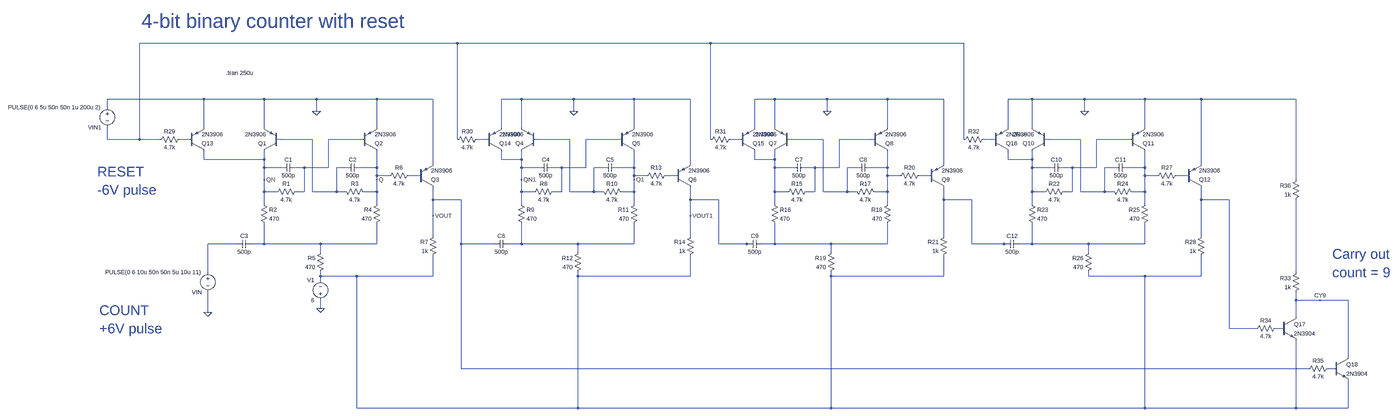
[diagram p0: schematic couter_4bit.asc, whole sheet]
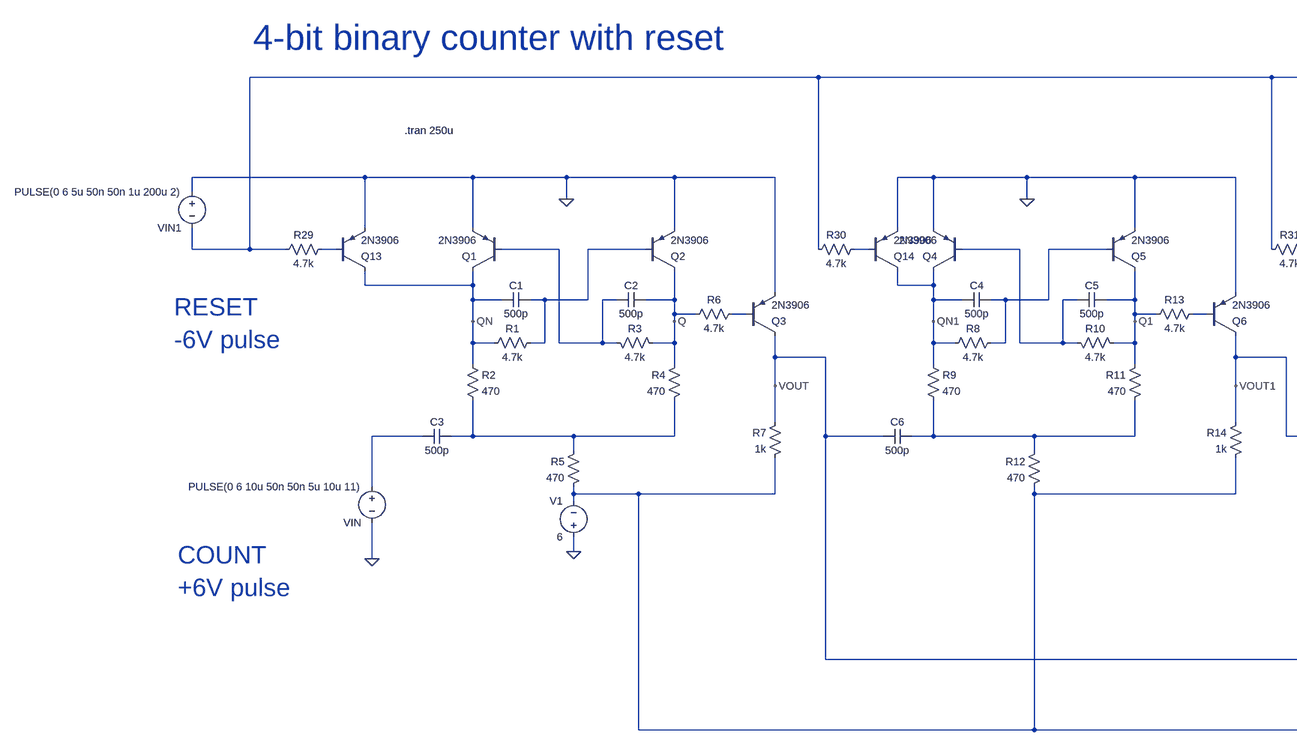
[diagram p1: schematic couter_4bit.asc, part, row 1 of 1, column 1 of 2]
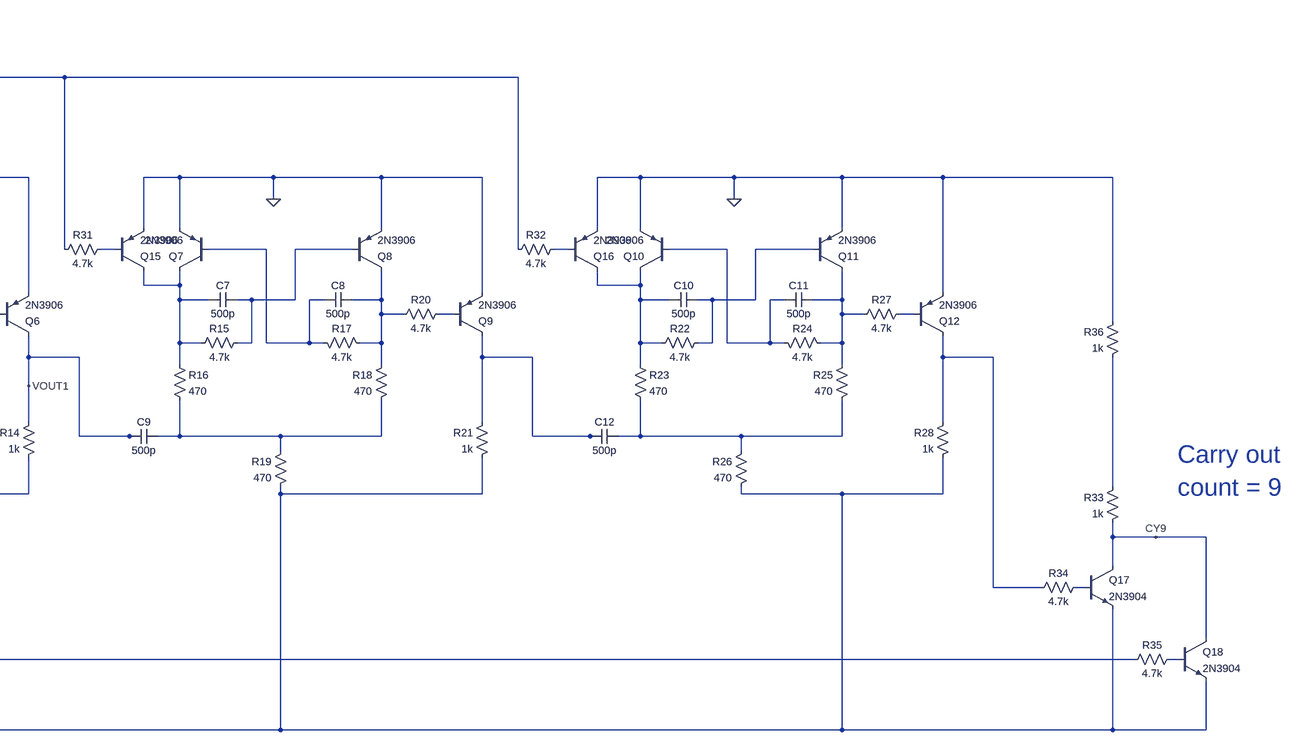
[diagram p2: schematic couter_4bit.asc, part, row 1 of 1, column 2 of 2]
couter_4bit.asc, the LTspice schematic file:
Version 4
SHEET 1 4568 1448
WIRE 688 -208 -576 -208
WIRE 1696 -208 688 -208
WIRE 2704 -208 1696 -208
WIRE -320 48 -704 48
WIRE -80 48 -320 48
WIRE 128 48 -80 48
WIRE 368 48 128 48
WIRE 592 48 368 48
WIRE 944 48 864 48
WIRE 1152 48 944 48
WIRE 1392 48 1152 48
WIRE 1616 48 1392 48
WIRE 1952 48 1872 48
WIRE 2160 48 1952 48
WIRE 2400 48 2160 48
WIRE 2624 48 2400 48
WIRE 2976 48 2880 48
WIRE 3184 48 2976 48
WIRE 3424 48 3184 48
WIRE 3648 48 3424 48
WIRE 4144 48 3648 48
WIRE -704 80 -704 48
WIRE 128 96 128 48
WIRE 1152 96 1152 48
WIRE 2160 96 2160 48
WIRE 3184 96 3184 48
WIRE -320 160 -320 48
WIRE -80 160 -80 48
WIRE 368 160 368 48
WIRE 864 160 864 48
WIRE 944 160 944 48
WIRE 1392 160 1392 48
WIRE 1872 160 1872 48
WIRE 1952 160 1952 48
WIRE 2400 160 2400 48
WIRE 2880 160 2880 48
WIRE 2976 160 2976 48
WIRE 3424 160 3424 48
WIRE -704 208 -704 160
WIRE -576 208 -576 -208
WIRE -576 208 -704 208
WIRE -496 208 -576 208
WIRE -384 208 -416 208
WIRE 112 208 -16 208
WIRE 304 208 176 208
WIRE 688 208 688 -208
WIRE 800 208 768 208
WIRE 1136 208 1008 208
WIRE 1328 208 1200 208
WIRE 1696 208 1696 -208
WIRE 1808 208 1776 208
WIRE 2144 208 2016 208
WIRE 2336 208 2208 208
WIRE 2704 208 2704 -208
WIRE 2816 208 2784 208
WIRE 3168 208 3040 208
WIRE 3360 208 3232 208
WIRE -320 288 -320 256
WIRE -80 288 -80 256
WIRE -80 288 -320 288
WIRE 864 288 864 256
WIRE 944 288 944 256
WIRE 944 288 864 288
WIRE 1872 288 1872 256
WIRE 1952 288 1952 256
WIRE 1952 288 1872 288
WIRE 2880 288 2880 256
WIRE 2976 288 2976 256
WIRE 2976 288 2880 288
WIRE 592 304 592 48
WIRE 1616 304 1616 48
WIRE 2624 304 2624 48
WIRE 3648 304 3648 48
WIRE -80 320 -80 288
WIRE -16 320 -80 320
WIRE 80 320 48 320
WIRE 176 320 176 208
WIRE 176 320 80 320
WIRE 240 320 208 320
WIRE 368 320 368 256
WIRE 368 320 304 320
WIRE 944 320 944 288
WIRE 1008 320 944 320
WIRE 1104 320 1072 320
WIRE 1200 320 1200 208
WIRE 1200 320 1104 320
WIRE 1264 320 1232 320
WIRE 1392 320 1392 256
WIRE 1392 320 1328 320
WIRE 1952 320 1952 288
WIRE 2016 320 1952 320
WIRE 2112 320 2080 320
WIRE 2208 320 2208 208
WIRE 2208 320 2112 320
WIRE 2272 320 2240 320
WIRE 2400 320 2400 256
WIRE 2400 320 2336 320
WIRE 2976 320 2976 288
WIRE 3040 320 2976 320
WIRE 3136 320 3104 320
WIRE 3232 320 3232 208
WIRE 3232 320 3136 320
WIRE 3296 320 3264 320
WIRE 3424 320 3424 256
WIRE 3424 320 3360 320
WIRE 368 352 368 320
WIRE 416 352 368 352
WIRE 528 352 496 352
WIRE 1392 352 1392 320
WIRE 1440 352 1392 352
WIRE 1552 352 1520 352
WIRE 2400 352 2400 320
WIRE 2448 352 2400 352
WIRE 2560 352 2528 352
WIRE 3424 352 3424 320
WIRE 3472 352 3424 352
WIRE 3584 352 3552 352
WIRE -80 368 -80 320
WIRE 368 368 368 352
WIRE 944 368 944 320
WIRE 1392 368 1392 352
WIRE 4144 368 4144 48
WIRE -80 416 -80 368
WIRE -32 416 -80 416
WIRE 80 416 80 320
WIRE 80 416 48 416
WIRE 112 416 112 208
WIRE 208 416 208 320
WIRE 208 416 112 416
WIRE 240 416 208 416
WIRE 368 416 368 368
WIRE 368 416 320 416
WIRE 944 416 944 368
WIRE 992 416 944 416
WIRE 1104 416 1104 320
WIRE 1104 416 1072 416
WIRE 1136 416 1136 208
WIRE 1232 416 1232 320
WIRE 1232 416 1136 416
WIRE 1264 416 1232 416
WIRE 1392 416 1392 368
WIRE 1392 416 1344 416
WIRE 1952 416 1952 320
WIRE 2000 416 1952 416
WIRE 2112 416 2112 320
WIRE 2112 416 2080 416
WIRE 2144 416 2144 208
WIRE 2240 416 2240 320
WIRE 2240 416 2144 416
WIRE 2272 416 2240 416
WIRE 2400 416 2400 352
WIRE 2400 416 2352 416
WIRE 2976 416 2976 320
WIRE 3024 416 2976 416
WIRE 3136 416 3136 320
WIRE 3136 416 3104 416
WIRE 3168 416 3168 208
WIRE 3264 416 3264 320
WIRE 3264 416 3168 416
WIRE 3296 416 3264 416
WIRE 3424 416 3424 352
WIRE 3424 416 3376 416
WIRE 592 448 592 400
WIRE 704 448 592 448
WIRE 1616 448 1616 400
WIRE 1728 448 1616 448
WIRE 2624 448 2624 400
WIRE 2736 448 2624 448
WIRE 3648 448 3648 400
WIRE 3760 448 3648 448
WIRE -80 464 -80 416
WIRE 368 464 368 416
WIRE 944 464 944 416
WIRE 1392 464 1392 416
WIRE 1952 464 1952 416
WIRE 2400 464 2400 416
WIRE 2976 464 2976 416
WIRE 3424 464 3424 416
WIRE 592 512 592 448
WIRE 1616 512 1616 448
WIRE 592 592 592 512
WIRE 1616 592 1616 512
WIRE 2624 592 2624 448
WIRE 3648 592 3648 448
WIRE -192 624 -304 624
WIRE -80 624 -80 544
WIRE -80 624 -128 624
WIRE 144 624 -80 624
WIRE 368 624 368 544
WIRE 368 624 144 624
WIRE 704 624 704 448
WIRE 832 624 704 624
WIRE 944 624 944 544
WIRE 944 624 896 624
WIRE 1168 624 944 624
WIRE 1392 624 1392 544
WIRE 1392 624 1168 624
WIRE 1728 624 1728 448
WIRE 1840 624 1728 624
WIRE 1856 624 1840 624
WIRE 1952 624 1952 544
WIRE 1952 624 1904 624
WIRE 2176 624 1952 624
WIRE 2400 624 2400 544
WIRE 2400 624 2176 624
WIRE 2736 624 2736 448
WIRE 2864 624 2736 624
WIRE 2880 624 2864 624
WIRE 2976 624 2976 544
WIRE 2976 624 2928 624
WIRE 3200 624 2976 624
WIRE 3424 624 3424 544
WIRE 3424 624 3200 624
WIRE 144 656 144 624
WIRE 1168 656 1168 624
WIRE 2176 656 2176 624
WIRE 3200 656 3200 624
WIRE -304 736 -304 624
WIRE 4144 736 4144 448
WIRE 144 752 144 736
WIRE 288 752 144 752
WIRE 592 752 592 672
WIRE 592 752 288 752
WIRE 1168 752 1168 736
WIRE 1616 752 1616 672
WIRE 1616 752 1168 752
WIRE 2176 752 2176 736
WIRE 2624 752 2624 672
WIRE 2624 752 2176 752
WIRE 3200 752 3200 736
WIRE 3424 752 3200 752
WIRE 3648 752 3648 672
WIRE 3648 752 3424 752
WIRE 144 768 144 752
WIRE 4144 848 4144 816
WIRE 4240 848 4144 848
WIRE 4352 848 4240 848
WIRE 144 880 144 848
WIRE -304 896 -304 816
WIRE 4144 912 4144 848
WIRE 3760 960 3760 448
WIRE 3984 960 3760 960
WIRE 4080 960 4064 960
WIRE 4352 1072 4352 848
WIRE 704 1120 704 624
WIRE 4192 1120 704 1120
WIRE 4288 1120 4272 1120
WIRE 288 1440 288 752
WIRE 1168 1440 1168 752
WIRE 1168 1440 288 1440
WIRE 2176 1440 2176 752
WIRE 2176 1440 1168 1440
WIRE 3424 1440 3424 752
WIRE 3424 1440 2176 1440
WIRE 4144 1440 4144 1008
WIRE 4144 1440 3424 1440
WIRE 4352 1440 4352 1168
WIRE 4352 1440 4144 1440
FLAG 128 96 0
FLAG 144 880 0
FLAG -304 896 0
FLAG 368 368 Q
FLAG -80 368 QN
FLAG 592 512 VOUT
FLAG 1152 96 0
FLAG 1392 368 Q1
FLAG 944 368 QN1
FLAG 1616 512 VOUT1
FLAG 2160 96 0
FLAG 3184 96 0
FLAG 4240 848 CY9
SYMBOL pnp -16 256 R180
SYMATTR InstName Q1
SYMATTR Value 2N3906
SYMBOL cap 48 304 R90
WINDOW 0 0 32 VBottom 2
WINDOW 3 32 32 VTop 2
SYMATTR InstName C1
SYMATTR Value 500p
SYMBOL res 64 400 R90
WINDOW 0 0 56 VBottom 2
WINDOW 3 32 56 VTop 2
SYMATTR InstName R1
SYMATTR Value 4.7k
SYMBOL res -96 448 R0
SYMATTR InstName R2
SYMATTR Value 470
SYMBOL pnp 304 256 M180
SYMATTR InstName Q2
SYMATTR Value 2N3906
SYMBOL cap 240 304 M90
WINDOW 0 0 32 VBottom 2
WINDOW 3 32 32 VTop 2
SYMATTR InstName C2
SYMATTR Value 500p
SYMBOL res 224 400 M90
WINDOW 0 0 56 VBottom 2
WINDOW 3 32 56 VTop 2
SYMATTR InstName R3
SYMATTR Value 4.7k
SYMBOL res 384 448 M0
SYMATTR InstName R4
SYMATTR Value 470
SYMBOL res 160 640 M0
SYMATTR InstName R5
SYMATTR Value 470
SYMBOL cap -128 608 R90
WINDOW 0 0 32 VBottom 2
WINDOW 3 32 32 VTop 2
SYMATTR InstName C3
SYMATTR Value 500p
SYMBOL voltage 144 864 R180
WINDOW 0 24 96 Left 2
WINDOW 3 24 16 Left 2
WINDOW 123 0 0 Left 0
WINDOW 39 0 0 Left 0
SYMATTR InstName V1
SYMATTR Value 6
SYMBOL voltage -304 720 M0
WINDOW 0 24 96 Left 2
WINDOW 3 24 16 Left 2
WINDOW 123 0 0 Left 0
WINDOW 39 0 0 Left 0
SYMATTR InstName VIN
SYMATTR Value PULSE(0 6 10u 50n 50n 5u 10u 11)
SYMBOL pnp 528 400 M180
SYMATTR InstName Q3
SYMATTR Value 2N3906
SYMBOL res 512 336 R90
WINDOW 0 0 56 VBottom 2
WINDOW 3 32 56 VTop 2
SYMATTR InstName R6
SYMATTR Value 4.7k
SYMBOL res 608 576 M0
SYMATTR InstName R7
SYMATTR Value 1k
SYMBOL pnp 1008 256 R180
SYMATTR InstName Q4
SYMATTR Value 2N3906
SYMBOL cap 1072 304 R90
WINDOW 0 0 32 VBottom 2
WINDOW 3 32 32 VTop 2
SYMATTR InstName C4
SYMATTR Value 500p
SYMBOL res 1088 400 R90
WINDOW 0 0 56 VBottom 2
WINDOW 3 32 56 VTop 2
SYMATTR InstName R8
SYMATTR Value 4.7k
SYMBOL res 928 448 R0
SYMATTR InstName R9
SYMATTR Value 470
SYMBOL pnp 1328 256 M180
SYMATTR InstName Q5
SYMATTR Value 2N3906
SYMBOL cap 1264 304 M90
WINDOW 0 0 32 VBottom 2
WINDOW 3 32 32 VTop 2
SYMATTR InstName C5
SYMATTR Value 500p
SYMBOL res 1248 400 M90
WINDOW 0 0 56 VBottom 2
WINDOW 3 32 56 VTop 2
SYMATTR InstName R10
SYMATTR Value 4.7k
SYMBOL res 1408 448 M0
SYMATTR InstName R11
SYMATTR Value 470
SYMBOL res 1184 640 M0
SYMATTR InstName R12
SYMATTR Value 470
SYMBOL cap 896 608 R90
WINDOW 0 0 32 VBottom 2
WINDOW 3 32 32 VTop 2
SYMATTR InstName C6
SYMATTR Value 500p
SYMBOL pnp 1552 400 M180
SYMATTR InstName Q6
SYMATTR Value 2N3906
SYMBOL res 1536 336 R90
WINDOW 0 0 56 VBottom 2
WINDOW 3 32 56 VTop 2
SYMATTR InstName R13
SYMATTR Value 4.7k
SYMBOL res 1632 576 M0
SYMATTR InstName R14
SYMATTR Value 1k
SYMBOL pnp 2016 256 R180
SYMATTR InstName Q7
SYMATTR Value 2N3906
SYMBOL cap 2080 304 R90
WINDOW 0 0 32 VBottom 2
WINDOW 3 32 32 VTop 2
SYMATTR InstName C7
SYMATTR Value 500p
SYMBOL res 2096 400 R90
WINDOW 0 0 56 VBottom 2
WINDOW 3 32 56 VTop 2
SYMATTR InstName R15
SYMATTR Value 4.7k
SYMBOL res 1936 448 R0
SYMATTR InstName R16
SYMATTR Value 470
SYMBOL pnp 2336 256 M180
SYMATTR InstName Q8
SYMATTR Value 2N3906
SYMBOL cap 2272 304 M90
WINDOW 0 0 32 VBottom 2
WINDOW 3 32 32 VTop 2
SYMATTR InstName C8
SYMATTR Value 500p
SYMBOL res 2256 400 M90
WINDOW 0 0 56 VBottom 2
WINDOW 3 32 56 VTop 2
SYMATTR InstName R17
SYMATTR Value 4.7k
SYMBOL res 2416 448 M0
SYMATTR InstName R18
SYMATTR Value 470
SYMBOL res 2192 640 M0
SYMATTR InstName R19
SYMATTR Value 470
SYMBOL cap 1904 608 R90
WINDOW 0 0 32 VBottom 2
WINDOW 3 32 32 VTop 2
SYMATTR InstName C9
SYMATTR Value 500p
SYMBOL pnp 2560 400 M180
SYMATTR InstName Q9
SYMATTR Value 2N3906
SYMBOL res 2544 336 R90
WINDOW 0 0 56 VBottom 2
WINDOW 3 32 56 VTop 2
SYMATTR InstName R20
SYMATTR Value 4.7k
SYMBOL res 2640 576 M0
SYMATTR InstName R21
SYMATTR Value 1k
SYMBOL pnp 3040 256 R180
SYMATTR InstName Q10
SYMATTR Value 2N3906
SYMBOL cap 3104 304 R90
WINDOW 0 0 32 VBottom 2
WINDOW 3 32 32 VTop 2
SYMATTR InstName C10
SYMATTR Value 500p
SYMBOL res 3120 400 R90
WINDOW 0 0 56 VBottom 2
WINDOW 3 32 56 VTop 2
SYMATTR InstName R22
SYMATTR Value 4.7k
SYMBOL res 2960 448 R0
SYMATTR InstName R23
SYMATTR Value 470
SYMBOL pnp 3360 256 M180
SYMATTR InstName Q11
SYMATTR Value 2N3906
SYMBOL cap 3296 304 M90
WINDOW 0 0 32 VBottom 2
WINDOW 3 32 32 VTop 2
SYMATTR InstName C11
SYMATTR Value 500p
SYMBOL res 3280 400 M90
WINDOW 0 0 56 VBottom 2
WINDOW 3 32 56 VTop 2
SYMATTR InstName R24
SYMATTR Value 4.7k
SYMBOL res 3440 448 M0
SYMATTR InstName R25
SYMATTR Value 470
SYMBOL res 3216 640 M0
SYMATTR InstName R26
SYMATTR Value 470
SYMBOL cap 2928 608 R90
WINDOW 0 0 32 VBottom 2
WINDOW 3 32 32 VTop 2
SYMATTR InstName C12
SYMATTR Value 500p
SYMBOL pnp 3584 400 M180
SYMATTR InstName Q12
SYMATTR Value 2N3906
SYMBOL res 3568 336 R90
WINDOW 0 0 56 VBottom 2
WINDOW 3 32 56 VTop 2
SYMATTR InstName R27
SYMATTR Value 4.7k
SYMBOL res 3664 576 M0
SYMATTR InstName R28
SYMATTR Value 1k
SYMBOL pnp -384 256 M180
SYMATTR InstName Q13
SYMATTR Value 2N3906
SYMBOL res -400 192 R90
WINDOW 0 0 56 VBottom 2
WINDOW 3 32 56 VTop 2
SYMATTR InstName R29
SYMATTR Value 4.7k
SYMBOL voltage -704 64 M0
WINDOW 0 24 96 Left 2
WINDOW 3 24 16 Left 2
WINDOW 123 0 0 Left 0
WINDOW 39 0 0 Left 0
SYMATTR InstName VIN1
SYMATTR Value PULSE(0 6 5u 50n 50n 1u 200u 2)
SYMBOL pnp 800 256 M180
SYMATTR InstName Q14
SYMATTR Value 2N3906
SYMBOL res 784 192 R90
WINDOW 0 0 56 VBottom 2
WINDOW 3 32 56 VTop 2
SYMATTR InstName R30
SYMATTR Value 4.7k
SYMBOL pnp 1808 256 M180
SYMATTR InstName Q15
SYMATTR Value 2N3906
SYMBOL res 1792 192 R90
WINDOW 0 0 56 VBottom 2
WINDOW 3 32 56 VTop 2
SYMATTR InstName R31
SYMATTR Value 4.7k
SYMBOL pnp 2816 256 M180
SYMATTR InstName Q16
SYMATTR Value 2N3906
SYMBOL res 2800 192 R90
WINDOW 0 0 56 VBottom 2
WINDOW 3 32 56 VTop 2
SYMATTR InstName R32
SYMATTR Value 4.7k
SYMBOL res 4080 944 R90
WINDOW 0 0 56 VBottom 2
WINDOW 3 32 56 VTop 2
SYMATTR InstName R34
SYMATTR Value 4.7k
SYMBOL res 4288 1104 R90
WINDOW 0 0 56 VBottom 2
WINDOW 3 32 56 VTop 2
SYMATTR InstName R35
SYMATTR Value 4.7k
SYMBOL npn 4080 912 R0
SYMATTR InstName Q17
SYMATTR Value 2N3904
SYMBOL npn 4288 1072 R0
SYMATTR InstName Q18
SYMATTR Value 2N3904
SYMBOL res 4160 720 M0
SYMATTR InstName R33
SYMATTR Value 1k
SYMBOL res 4160 352 M0
SYMATTR InstName R36
SYMATTR Value 1k
TEXT -232 -56 Left 2 !.tran 250u
TEXT -568 -296 Left 6 ;4-bit binary counter with reset
TEXT -744 336 Left 5 ;RESET\n-6V pulse
TEXT -736 888 Left 5 ;COUNT\n+6V pulse
TEXT 4288 664 Left 5 ;Carry out\ncount = 9

The netlist it stands for:
* couter_4bit.asc
Q1 QN N003 0 0 2N3906
C1 N004 QN 500p
R1 N004 QN 4.7k
R2 QN N025 470
Q2 Q N004 0 0 2N3906
C2 N003 Q 500p
R3 N003 Q 4.7k
R4 Q N025 470
R5 N025 N030 470
C3 N025 N024 500p
V1 0 N030 6
VIN N024 0 PULSE(0 6 10u 50n 50n 5u 10u 11)
Q3 VOUT N018 0 0 2N3906
R6 N018 Q 4.7k
R7 VOUT N030 1k
Q4 QN1 N006 0 0 2N3906
C4 N007 QN1 500p
R8 N007 QN1 4.7k
R9 QN1 N026 470
Q5 Q1 N007 0 0 2N3906
C5 N006 Q1 500p
R10 N006 Q1 4.7k
R11 Q1 N026 470
R12 N026 N030 470
C6 N026 VOUT 500p
Q6 VOUT1 N019 0 0 2N3906
R13 N019 Q1 4.7k
R14 VOUT1 N030 1k
Q7 N014 N009 0 0 2N3906
C7 N010 N014 500p
R15 N010 N014 4.7k
R16 N014 N027 470
Q8 N016 N010 0 0 2N3906
C8 N009 N016 500p
R17 N009 N016 4.7k
R18 N016 N027 470
R19 N027 N030 470
C9 N027 VOUT1 500p
Q9 N022 N020 0 0 2N3906
R20 N020 N016 4.7k
R21 N022 N030 1k
Q10 N015 N012 0 0 2N3906
C10 N013 N015 500p
R22 N013 N015 4.7k
R23 N015 N028 470
Q11 N017 N013 0 0 2N3906
C11 N012 N017 500p
R24 N012 N017 4.7k
R25 N017 N028 470
R26 N028 N030 470
C12 N028 N022 500p
Q12 N023 N021 0 0 2N3906
R27 N021 N017 4.7k
R28 N023 N030 1k
Q13 QN N002 0 0 2N3906
R29 N002 N001 4.7k
VIN1 0 N001 PULSE(0 6 5u 50n 50n 1u 200u 2)
Q14 QN1 N005 0 0 2N3906
R30 N005 N001 4.7k
Q15 N014 N008 0 0 2N3906
R31 N008 N001 4.7k
Q16 N015 N011 0 0 2N3906
R32 N011 N001 4.7k
R34 N031 N023 4.7k
R35 N032 VOUT 4.7k
Q17 CY9 N031 N030 0 2N3904
Q18 CY9 N032 N030 0 2N3904
R33 N029 CY9 1k
R36 0 N029 1k
.model NPN NPN
.model PNP PNP
.lib standard.bjt
.tran 250u
* 4-bit binary counter with reset
* RESET
* -6V pulse
* COUNT
* +6V pulse
* Carry out
* count = 9
.backanno
.end